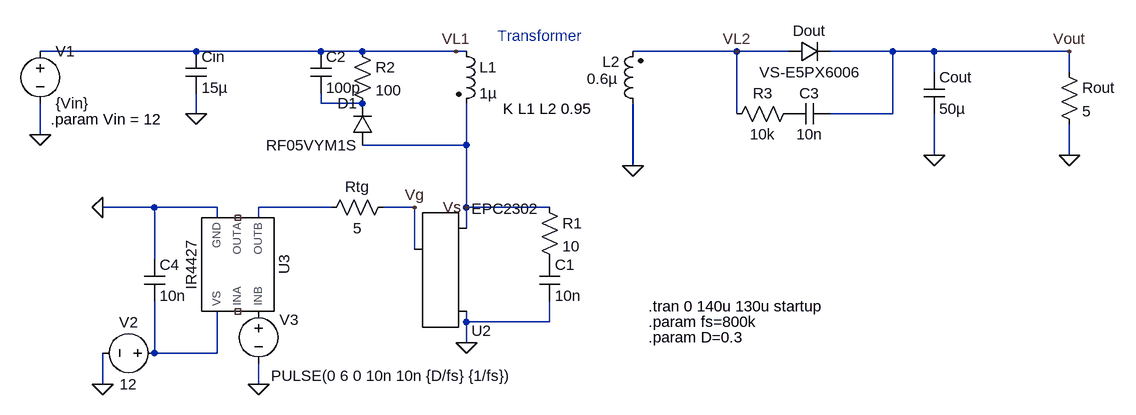
[diagram p0: schematic Flyback V5.asc]
Flyback V5.asc, the LTspice schematic file:
Version 4
SHEET 1 1032 680
WIRE -496 -288 -736 -288
WIRE -304 -288 -496 -288
WIRE -240 -288 -304 -288
WIRE -96 -288 -240 -288
WIRE -80 -288 -96 -288
WIRE 336 -288 176 -288
WIRE 416 -288 336 -288
WIRE 576 -288 480 -288
WIRE 640 -288 576 -288
WIRE 848 -288 640 -288
WIRE 640 -256 640 -288
WIRE 848 -256 848 -288
WIRE -304 -208 -304 -224
WIRE -240 -208 -304 -208
WIRE -496 -192 -496 -224
WIRE 336 -192 336 -288
WIRE 576 -192 576 -288
WIRE 576 -192 480 -192
WIRE -736 -160 -736 -208
WIRE -80 -144 -80 -208
WIRE -80 -144 -240 -144
WIRE 640 -128 640 -192
WIRE 848 -128 848 -176
WIRE 176 -112 176 -208
WIRE -560 -48 -640 -48
WIRE -464 -48 -560 -48
WIRE -288 -48 -400 -48
WIRE -160 -48 -208 -48
WIRE -80 -48 -80 -144
WIRE 48 -48 -80 -48
WIRE -464 -32 -464 -48
WIRE -400 -32 -400 -48
WIRE -80 -16 -80 -48
WIRE -160 16 -160 -48
WIRE -560 32 -560 -48
WIRE -80 128 -80 112
WIRE 48 128 48 96
WIRE 48 128 -80 128
WIRE -80 160 -80 128
WIRE -560 176 -560 96
WIRE -464 176 -464 112
WIRE -464 176 -560 176
WIRE -640 224 -640 176
WIRE -400 224 -400 192
FLAG 176 -112 0
FLAG 848 -128 0
FLAG -80 160 0
FLAG -736 -160 0
FLAG 848 -288 Vout
FLAG -96 -288 VL1
FLAG 336 -288 VL2
FLAG -640 224 0
FLAG -640 -48 0
FLAG -400 224 0
FLAG -160 -48 Vg
FLAG -80 -48 Vs
FLAG 640 -128 0
FLAG -496 -192 0
SYMBOL ind2 -96 -304 R0
SYMATTR InstName L1
SYMATTR Value 1µ
SYMBOL ind2 192 -192 R180
WINDOW 0 36 80 Left 2
WINDOW 3 39 54 Left 2
SYMATTR InstName L2
SYMATTR Value 0.6µ
SYMBOL voltage -736 -304 R0
WINDOW 123 0 0 Left 0
WINDOW 39 24 44 Left 2
SYMATTR InstName V1
SYMATTR Value {Vin}
SYMBOL diode 416 -272 R270
WINDOW 0 32 32 VTop 2
WINDOW 3 0 32 VBottom 2
SYMATTR InstName Dout
SYMATTR Value VS-E5PX6006
SYMBOL res 832 -272 R0
SYMATTR InstName Rout
SYMATTR Value 5
SYMBOL voltage -544 176 R90
WINDOW 0 -32 56 VBottom 2
WINDOW 3 32 56 VTop 2
WINDOW 123 0 0 Left 0
WINDOW 39 0 0 Left 0
SYMATTR InstName V2
SYMATTR Value 12
SYMBOL voltage -400 96 R0
WINDOW 123 0 0 Left 0
WINDOW 39 0 0 Left 0
WINDOW 3 19 115 Left 2
WINDOW 0 32 29 Left 2
SYMATTR Value PULSE(0 6 0 10n 10n {D/fs} {1/fs})
SYMATTR InstName V3
SYMBOL IR4427 -432 32 R90
SYMATTR InstName U3
SYMBOL res -304 -32 R270
WINDOW 0 32 56 VTop 2
WINDOW 3 0 56 VBottom 2
SYMATTR InstName Rtg
SYMATTR Value 5
SYMBOL cap 624 -256 R0
SYMATTR InstName Cout
SYMATTR Value 50µ
SYMBOL cap -512 -288 R0
SYMATTR InstName Cin
SYMATTR Value 15µ
SYMBOL EPCGaN -160 16 M180
SYMATTR InstName U2
SYMATTR Value EPC2302
SYMBOL res 32 -64 R0
SYMATTR InstName R1
SYMATTR Value 10
SYMBOL cap 32 32 R0
SYMATTR InstName C1
SYMATTR Value 10n
SYMBOL cap -320 -288 R0
SYMATTR InstName C2
SYMATTR Value 100p
SYMBOL res -256 -304 R0
SYMATTR InstName R2
SYMATTR Value 100
SYMBOL diode -224 -144 R180
WINDOW 0 24 64 Left 2
WINDOW 3 24 0 Left 2
SYMATTR InstName D1
SYMATTR Value RF05VYM1S
SYMBOL res 432 -208 R90
WINDOW 0 0 56 VBottom 2
WINDOW 3 32 56 VTop 2
SYMATTR InstName R3
SYMATTR Value 10k
SYMBOL cap 480 -208 R90
WINDOW 0 0 32 VBottom 2
WINDOW 3 32 32 VTop 2
SYMATTR InstName C3
SYMATTR Value 10n
SYMBOL cap -576 32 R0
SYMATTR InstName C4
SYMATTR Value 10n
TEXT -24 -200 Left 2 !K L1 L2 0.95
TEXT -720 -184 Left 2 !.param Vin = 12
TEXT 200 104 Left 2 !.tran 0 140u 130u startup
TEXT 200 128 Left 2 !.param fs=800k
TEXT 200 152 Left 2 !.param D=0.3
TEXT -32 -312 Left 2 ;Transformer

The netlist it stands for:
* Flyback V5.asc
L1 VL1 Vs 1µ
L2 0 VL2 0.6µ
V1 VL1 0 {Vin}
Dout VL2 Vout VS-E5PX6006
Rout Vout 0 5
V2 N003 0 12
V3 P001 0 PULSE(0 6 0 10n 10n {D/fs} {1/fs})
XU3 N002 NC_01 0 P001 NC_02 N003 IR4427  ; pins OUTB OUTA GND INB INA VS
Rtg N002 Vg 5
Cout Vout 0 50µ
Cin VL1 0 15µ
XU2 Vg 0 Vs EPC2302
R1 Vs P002 10
C1 P002 0 10n
C2 VL1 N001 100p
R2 VL1 N001 100
D1 Vs N001 RF05VYM1S
R3 P003 VL2 10k
C3 Vout P003 10n
C4 0 N003 10n
.model D D
.lib standard.dio
K L1 L2 0.95
.param Vin = 12
.tran 0 140u 130u startup
.param fs=800k
.param D=0.3
* Transformer
.lib D:\Users\C1\Documents\C1_Repos\Technion_Project_A\LTSPICE\Components\Libraries\IR4427.lib
.backanno
.end